# EAGLE design StellaBlue (EAGLE 7.3.0)
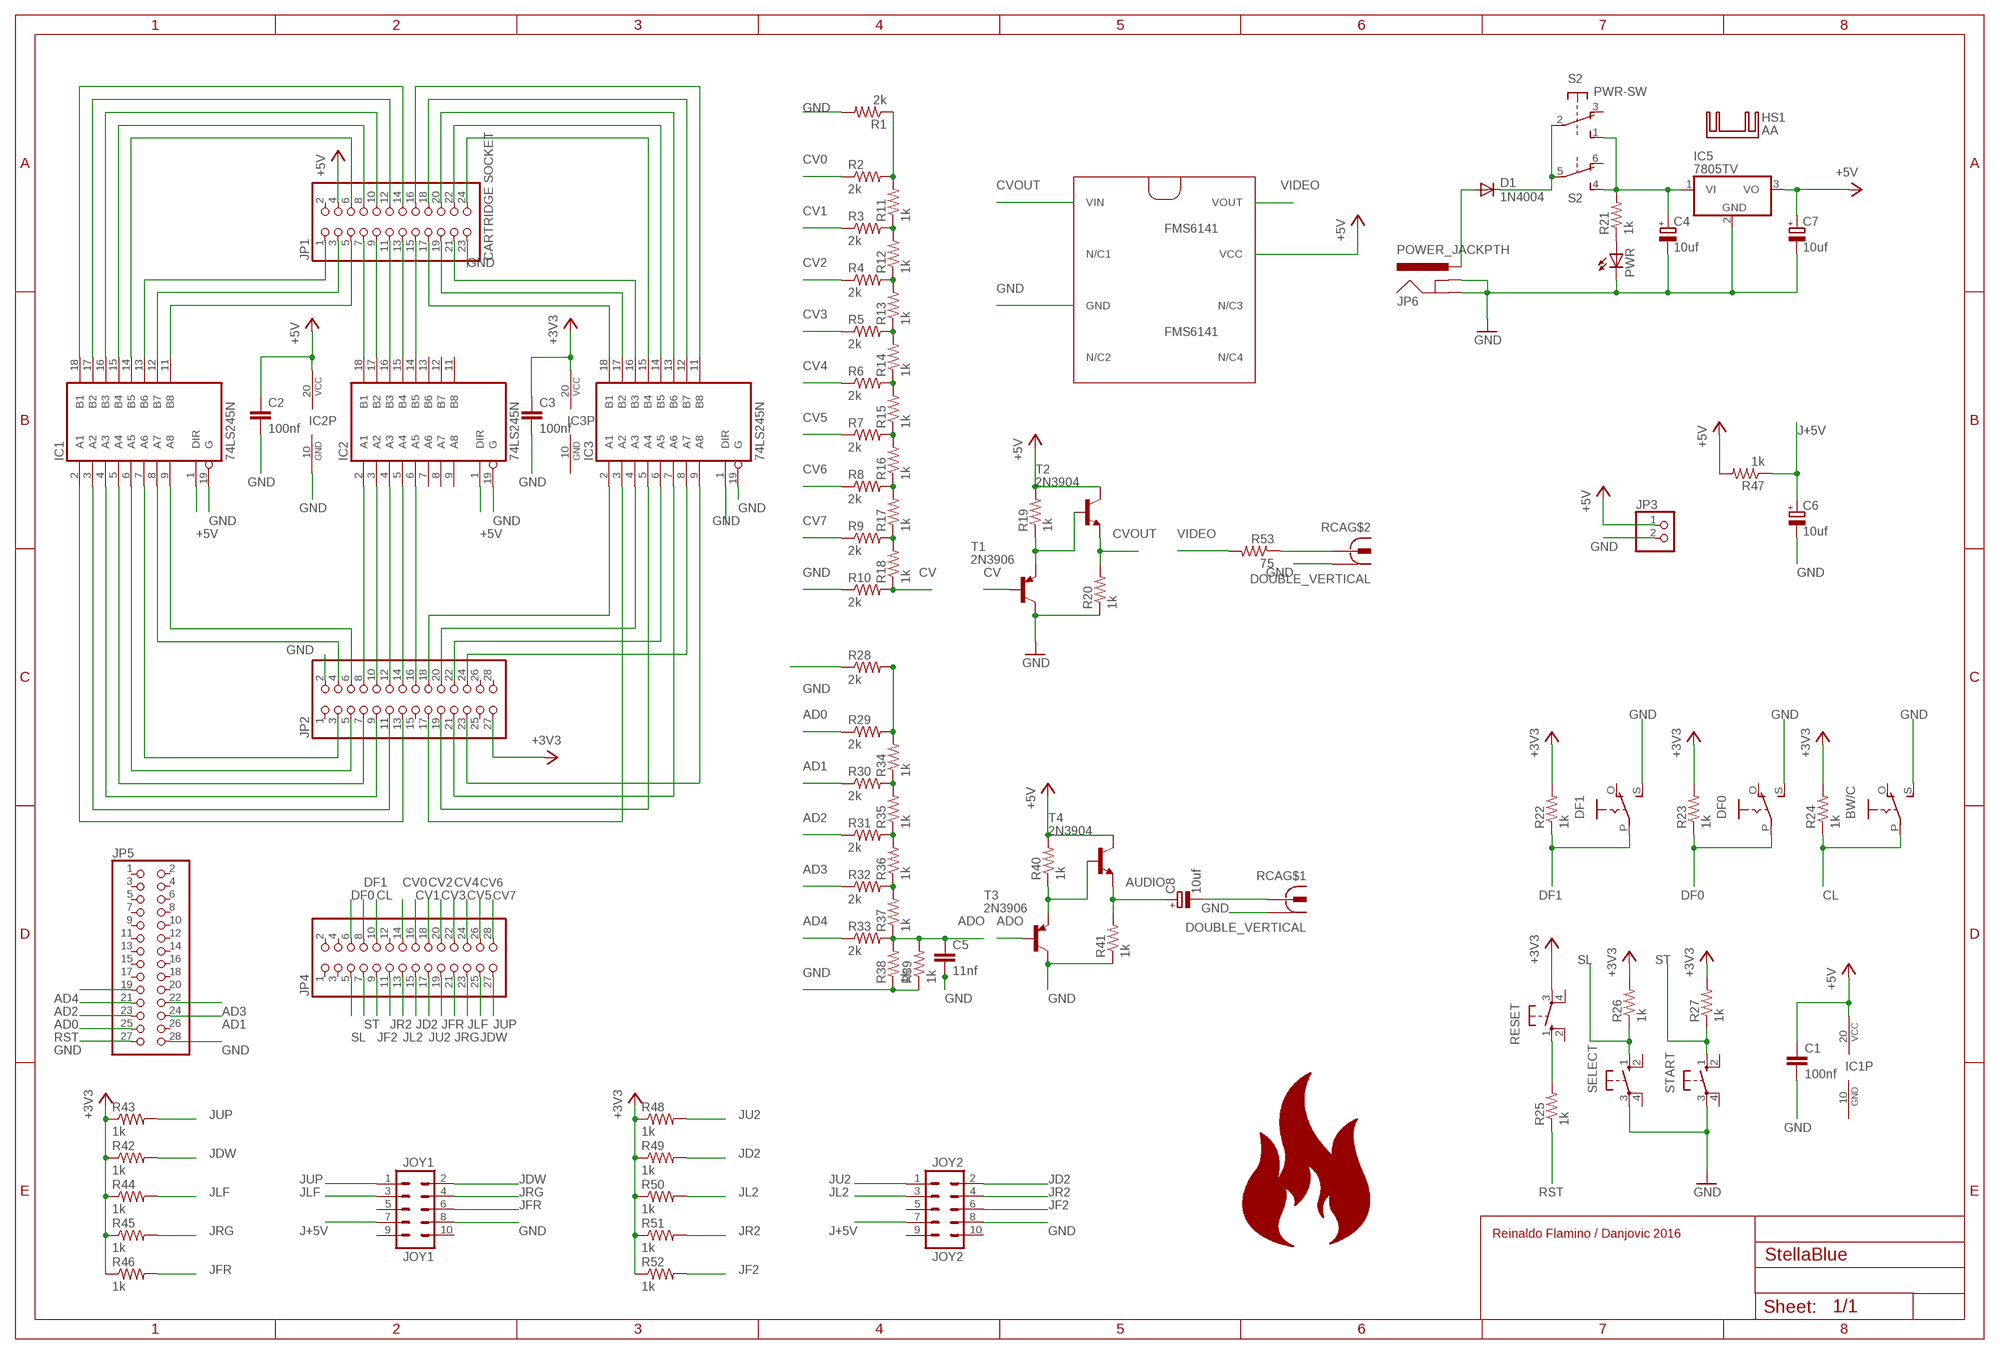
[diagram p0: schematic, sheet 1]

## Parts
BW/C  EG1218S  [EG1218]
C1  100nf  C5/2.5  [C5B2.5]
C2  100nf  C5/2.5  [C5B2.5]
C3  100nf  C5/2.5  [C5B2.5]
C4  10uf  CPOL-EUE2.5-6  [E2,5-6]
C5  11nf  C5/2.5  [C5B2.5]
C6  10uf  CPOL-EUTT2D6  [TT2D6]
C7  10uf  CPOL-EUE2.5-6  [E2,5-6]
C8  10uf  CPOL-EUE2.5-6  [E2,5-6]
D1  1N4004  [DO41-10]
DF0  EG1218S  [EG1218]
DF1  EG1218S  [EG1218]
HS1  AA  [AA]
IC1  74LS245N  [DIL20]
IC2  74LS245N  [DIL20]
IC3  74LS245N  [DIL20]
IC4  FMS6141  [SOIC8]
IC5  7805TV  [TO220V]
JOY1  JOY1  M05X2SHD_LOCK  [2X5-SHROUDED_LOCK]
JOY2  JOY2  M05X2SHD_LOCK  [2X5-SHROUDED_LOCK]
JP1  CARTRIDGE SOCKET  ATARI2600_SLOT  [ATARI2600_SLOT]
JP2  PINHD-2X14  [2X14]
JP3  PINHD-1X2/90  [1X02/90]
JP4  PINHD-2X14  [2X14]
JP5  PINHD-2X14  [2X14]
JP6  POWER_JACKPTH  [POWER_JACK_PTH]
PWR  LED3MM  [LED3MM]
R1  2k  R-US_0207/7  [0207/7]
R2  2k  R-US_0207/7  [0207/7]
R3  2k  R-US_0207/7  [0207/7]
R4  2k  R-US_0207/7  [0207/7]
R5  2k  R-US_0207/7  [0207/7]
R6  2k  R-US_0207/7  [0207/7]
R7  2k  R-US_0207/7  [0207/7]
R8  2k  R-US_0207/7  [0207/7]
R9  2k  R-US_0207/7  [0207/7]
R10  2k  R-US_0207/7  [0207/7]
R11  1k  R-US_0207/7  [0207/7]
R12  1k  R-US_0207/7  [0207/7]
R13  1k  R-US_0207/7  [0207/7]
R14  1k  R-US_0207/7  [0207/7]
R15  1k  R-US_0207/7  [0207/7]
R16  1k  R-US_0207/7  [0207/7]
R17  1k  R-US_0207/7  [0207/7]
R18  1k  R-US_0207/7  [0207/7]
R19  1k  R-US_0207/7  [0207/7]
R20  1k  R-US_0207/7  [0207/7]
R21  1k  R-US_0207/7  [0207/7]
R22  1k  R-US_0207/7  [0207/7]
R23  1k  R-US_0207/7  [0207/7]
R24  1k  R-US_0207/7  [0207/7]
R25  1k  R-US_0207/7  [0207/7]
R26  1k  R-US_0207/7  [0207/7]
R27  1k  R-US_0207/7  [0207/7]
R28  2k  R-US_0207/7  [0207/7]
R29  2k  R-US_0207/7  [0207/7]
R30  2k  R-US_0207/7  [0207/7]
R31  2k  R-US_0207/7  [0207/7]
R32  2k  R-US_0207/7  [0207/7]
R33  2k  R-US_0207/7  [0207/7]
R34  1k  R-US_0207/7  [0207/7]
R35  1k  R-US_0207/7  [0207/7]
R36  1k  R-US_0207/7  [0207/7]
R37  1k  R-US_0207/7  [0207/7]
R38  1k  R-US_0207/7  [0207/7]
R39  1k  R-US_0207/7  [0207/7]
R40  1k  R-US_0207/7  [0207/7]
R41  1k  R-US_0207/7  [0207/7]
R42  1k  R-US_0207/7  [0207/7]
R43  1k  R-US_0207/7  [0207/7]
R44  1k  R-US_0207/7  [0207/7]
R45  1k  R-US_0207/7  [0207/7]
R46  1k  R-US_0207/7  [0207/7]
R47  1k  R-US_0207/7  [0207/7]
R48  1k  R-US_0207/7  [0207/7]
R49  1k  R-US_0207/7  [0207/7]
R50  1k  R-US_0207/7  [0207/7]
R51  1k  R-US_0207/7  [0207/7]
R52  1k  R-US_0207/7  [0207/7]
R53  75  R-US_0207/7  [0207/7]
RCA  DOUBLE_VERTICAL  [DOUBLE-VERTICAL]
RESET  10-XX  [B3F-10XX]
S2  PWR-SW  9077-2  [9077-2]
SELECT  10-XX  [B3F-10XX]
START  10-XX  [B3F-10XX]
T1  2N3906  2N3906-PNP-TO92-EBC  [TO92-EBC]
T2  2N3904  2N3904-NPN-TO92-EBC  [TO92-EBC]
T3  2N3906  2N3906-PNP-TO92-EBC  [TO92-EBC]
T4  2N3904  2N3904-NPN-TO92-EBC  [TO92-EBC]

## Nets
+3V3: C3.1 IC3.20(VCC) JP2.27 R22.2 R23.2 R24.2 R26.2 R27.2 R42.1 R43.1 R44.1 R45.1 R46.1 R48.1 R49.1 R50.1 R51.1 R52.1 RESET.3(P)
+5V: C1.1 C2.1 C7.+ IC1.1(DIR) IC1.20(VCC) IC2.1(DIR) IC2.20(VCC) IC4.6(VCC) IC5.3(VO) JP1.4 JP3.1 R19.2 R40.2 R47.2 T2.C T4.C
AD0: JP5.23 R29.1
AD1: JP5.24 R30.1
AD2: JP5.21 R31.1
AD3: JP5.22 R32.1
AD4: JP5.19 R33.1
ADO: C5.1 R33.2 R37.1 R38.2 R39.2 T3.B
AUDIO: C8.+ R41.2 T4.E
CL: BW/C.P JP4.10 R24.1
CV: R10.2 R18.1 T1.B
CV0: JP4.14 R2.1
CV1: JP4.16 R3.1
CV2: JP4.18 R4.1
CV3: JP4.20 R5.1
CV4: JP4.22 R6.1
CV5: JP4.24 R7.1
CV6: JP4.26 R8.1
CV7: JP4.28 R9.1
CVOUT: IC4.1(VIN) R20.2 T2.E
DF0: DF0.P JP4.6 R23.1
DF1: DF1.P JP4.8 R22.1
GND: BW/C.S C1.2 C2.2 C3.2 C4.- C5.2 C6.- C7.- DF0.S DF1.S IC1.19(G) IC2.10(GND) IC2.19(G) IC3.1(DIR) IC3.19(G) IC4.3(GND) IC5.2(GND) JOY1.8 JOY2.8 JP1.23 JP2.2 JP3.2 JP5.27 JP5.28 JP6.GND JP6.GNDBREAK PWR.K(C) R1.2 R10.1 R20.1 R28.1 R38.1 R39.1 R41.1 RCA.HG RCA.LG SELECT.3(P) START.3(P) T1.C T3.C
J+5V: C6.+ JOY1.7 JOY2.7 R47.1
JD2: JOY2.2 JP4.15 R49.2
JDW: JOY1.2 JP4.25 R42.2
JF2: JOY2.6 JP4.9 R52.2
JFR: JOY1.6 JP4.19 R46.2
JL2: JOY2.3 JP4.13 R50.2
JLF: JOY1.3 JP4.23 R44.2
JR2: JOY2.4 JP4.11 R51.2
JRG: JOY1.4 JP4.21 R45.2
JU2: JOY2.1 JP4.17 R48.2
JUP: JOY1.1 JP4.27 R43.2
N$1: IC1.18(B1) JP1.14
N$2: IC1.17(B2) JP1.12
N$3: IC1.16(B3) JP1.10
N$4: IC1.15(B4) JP1.8
N$5: IC1.14(B5) JP1.6
N$6: IC1.13(B6) JP1.1
N$7: IC1.12(B7) JP1.3
N$8: IC1.11(B8) JP1.5
N$9: IC2.18(B1) JP1.7
N$10: IC2.17(B2) JP1.9
N$11: IC2.16(B3) JP1.11
N$12: IC2.15(B4) JP1.13
N$13: IC2.14(B5) JP1.15
N$14: IC3.18(B1) JP1.17
N$15: IC3.17(B2) JP1.19
N$16: IC3.16(B3) JP1.21
N$17: IC3.15(B4) JP1.24
N$18: IC3.14(B5) JP1.22
N$19: IC3.13(B6) JP1.20
N$20: IC3.12(B7) JP1.18
N$21: IC3.11(B8) JP1.16
N$22: IC1.2(A1) JP2.13
N$23: IC1.3(A2) JP2.11
N$24: IC1.4(A3) JP2.9
N$25: IC1.5(A4) JP2.7
N$26: IC1.6(A5) JP2.5
N$27: IC1.7(A6) JP2.3
N$28: IC1.8(A7) JP2.4
N$29: IC1.9(A8) JP2.6
N$30: IC2.2(A1) JP2.8
N$31: IC2.3(A2) JP2.10
N$32: IC2.4(A3) JP2.12
N$33: IC2.5(A4) JP2.14
N$34: IC2.6(A5) JP2.16
N$35: IC3.2(A1) JP2.18
N$36: IC3.3(A2) JP2.17
N$37: IC3.4(A3) JP2.20
N$38: IC3.5(A4) JP2.19
N$39: IC3.6(A5) JP2.22
N$40: IC3.7(A6) JP2.21
N$41: IC3.8(A7) JP2.24
N$42: IC3.9(A8) JP2.23
N$43: D1.A JP6.PWR
N$44: D1.C S2.2(1:P) S2.5(2:P)
N$45: R1.1 R2.2 R11.2
N$46: R3.2 R11.1 R12.2
N$47: R53.1 RCA.LS
N$49: C4.+ IC5.1(VI) R21.2 S2.1(1:S) S2.4(2:S)
N$50: R4.2 R12.1 R13.2
N$51: R5.2 R13.1 R14.2
N$52: R6.2 R14.1 R15.2
N$53: R7.2 R15.1 R16.2
N$54: R8.2 R16.1 R17.2
N$55: R9.2 R17.1 R18.2
N$57: R19.1 T1.E T2.B
N$58: PWR.A R21.1
N$59: R25.2 RESET.1(S)
N$62: R28.2 R29.2 R34.2
N$63: R30.2 R34.1 R35.2
N$64: R31.2 R35.1 R36.2
N$65: R32.2 R36.1 R37.2
N$67: R40.1 T3.E T4.B
N$68: C8.- RCA.HS
RST: JP5.25 R25.1
SL: JP4.5 R26.1 SELECT.1(S)
ST: JP4.7 R27.1 START.1(S)
VIDEO: IC4.5(VOUT) R53.2
Unconnected: BW/C.O DF0.O DF1.O IC2.7(A6) IC2.8(A7) IC2.9(A8) IC2.11(B8) IC2.12(B7) IC2.13(B6) IC4.2(N/C1) IC4.4(N/C2) IC4.7(N/C3) IC4.8(N/C4) JOY1.5 JOY1.9 JOY1.10 JOY2.5 JOY2.9 JOY2.10 JP1.2 JP2.1 JP2.15 JP2.25 JP2.26 JP2.28 JP4.1 JP4.2 JP4.3 JP4.4 JP4.12 JP5.1 JP5.2 JP5.3 JP5.4 JP5.5 JP5.6 JP5.7 JP5.8 JP5.9 JP5.10 JP5.11 JP5.12 JP5.13 JP5.14 JP5.15 JP5.16 JP5.17 JP5.18 JP5.20 JP5.26 RESET.2(S1) RESET.4(P1) S2.3(1:O) S2.6(2:O) SELECT.2(S1) SELECT.4(P1) START.2(S1) START.4(P1)

## Notes on the sheet
- Reinaldo Flamino / Danjovic 2016

## Power pins joined to a net without a drawn wire
GND: IC1.10(GND) IC3.10(GND)

## Library data of the parts
BW/C DF0 DF1 = adafruit:EG1218: SLIDING SWITCH 0.1" spacing through hole, vertical SPDT slide switch http://www.ladyada.net/library/pcb/eaglelibrary.html
C1-C3 C5 = capacitor-wima:C: CAPACITOR naming: grid - package width
C4 C6-C8 = resistor:CPOL-EU: POLARIZED CAPACITOR, European symbol
D1 = adafruit:1N4004: DIODE General purpose 1N400x type rectifier (With bigger pads) http://www.ladyada.net/library/pcb/eaglelibrary.html
HS1 = heatsink:AA
IC1-IC3 = 74xx-us:74*245: Octal BUS TRANSCEIVER, 3-state
IC4 = Misc:FMS6141: VIDEO FILTER
IC5 = linear:78*: Positive VOLTAGE REGULATOR Source: http://cache.national.com/ds/LM/LM78L05.pdf http://www.fairchildsemi.com/ds/LM/LM7805.pdf
JOY1 JOY2 = SparkFun-Connectors:M05X2: Header 5x2 Standard 10-pin dual row 0.1" header. Commonly used with AVR-ISP. Use with Spark Fun Electronics SKU: PRT-00778
JP1 = atari2600 card edge:ATARI2600_SLOT: Atari 2600 Slot connector Based on Sullins card edge connector 12/24 pin
JP2 JP4 JP5 = pinhead:PINHD-2X14: PIN HEADER
JP3 = pinhead:PINHD-1X2: PIN HEADER
JP6 = SparkFun-Connectors:POWER_JACK: Power Jack This is the standard 5.5mm barrel jack for power. The PTH is the most common, proven, reliable, footprint. The Slot footprint only works if the mill layer is transmitted to the PCB fab house so be warned. Mating wall wart : TOL-00298 (and others); PROD_ID: CONN-08197
PWR = led:LED: LED OSRAM: - CHIPLED LG R971, LG N971, LY N971, LG Q971, LY Q971, LO R971, LY R971 LH N974, LH R974 LS Q976, LO Q976, LY Q976 LO Q996 - Hyper CHIPLED LW Q18S LB Q993, LB Q99A, LB R99A - SideLED LS A670, LO A670, LY A670, LG A670, LP A670 LB A673, LV A673, LT A673, LW A673 LH A674 LY A675 LS A676, LA A676, LO A676, LY A676, LW A676 LS A679, LY A679, LG A679 - Hyper Micro SIDELED® LS Y876, LA Y876, LO Y876, LY Y876 LT Y87S - SmartLED LW L88C, LW L88S LB L89C, LB L89S, LG L890 LS L89K, LO L89K, LY L89K LS L896, LA L896, LO L896, LY L896 - TOPLED LS T670, LO T670, LY T670, LG T670, LP T670 LSG T670, LSP T670, LSY T670, LOP T670, LYG T670 LG T671, LOG T671, LSG T671 LB T673, LV T673, LT T673, LW T673 LH T674 LS T676, LA T676, LO T676, LY T676, LB T676, LH T676, LSB T676, LW T676 LB T67C, LV T67C, LT T67C, LS T67K, LO T67K, LY T67K, LW E67C LS E67B, LA E67B, LO E67B, LY E67B, LB E67C, LV E67C, LT E67C LW T67C LS T679, LY T679, LG T679 LS T770, LO T770, LY T770, LG T770, LP T770 LB T773, LV T773, LT T773, LW T773 LH T774 LS E675, LA E675, LY E675, LS T675 LS T776, LA T776, LO T776, LY T776, LB T776 LHGB T686 LT T68C, LB T68C - Hyper Mini TOPLED® LB M676 - Mini TOPLED Santana® LG M470 LS M47K, LO M47K, LY M47K Source: http://www.osram.convergy.de LUXEON: - LUMILED® LXK2-PW12-R00, LXK2-PW12-S00, LXK2-PW14-U00, LXK2-PW14-V00 LXK2-PM12-R00, LXK2-PM12-S00, LXK2-PM14-U00 LXK2-PE12-Q00, LXK2-PE12-R00, LXK2-PE12-S00, LXK2-PE14-T00, LXK2-PE14-U00 LXK2-PB12-K00, LXK2-PB12-L00, LXK2-PB12-M00, LXK2-PB14-N00, LXK2-PB14-P00, LXK2-PB14-Q00 LXK2-PR12-L00, LXK2-PR12-M00, LXK2-PR14-Q00, LXK2-PR14-R00 LXK2-PD12-Q00, LXK2-PD12-R00, LXK2-PD12-S00 LXK2-PH12-R00, LXK2-PH12-S00 LXK2-PL12-P00, LXK2-PL12-Q00, LXK2-PL12-R00 Source: www.luxeon.com KINGBRIGHT: KA-3528ASYC Source: www.kingbright.com
R1-R53 = resistor:R-US_: RESISTOR, American symbol
RCA = con-rca-board:DOUBLE_VERTICAL
RESET SELECT START = switch-omron:10-XX: OMRON SWITCH; MPN: B3F-1000; OC_FARNELL: 176432; OC_NEWARK: 36M3542
S2 = switch-misc:9077-2: MARQUARDT SWITCH 9077.0200 Distributor: Buerklin <https://www.buerklin.com/default.asp?event=ShowArtikel%2812G2822%29&l=d&jump=ArtNr_12G2822>
T1 T3 = transistor-neu-to92:*-PNP-: PNP Transistror
T2 T4 = transistor-neu-to92:*-NPN-: NPN Transistror

## Board
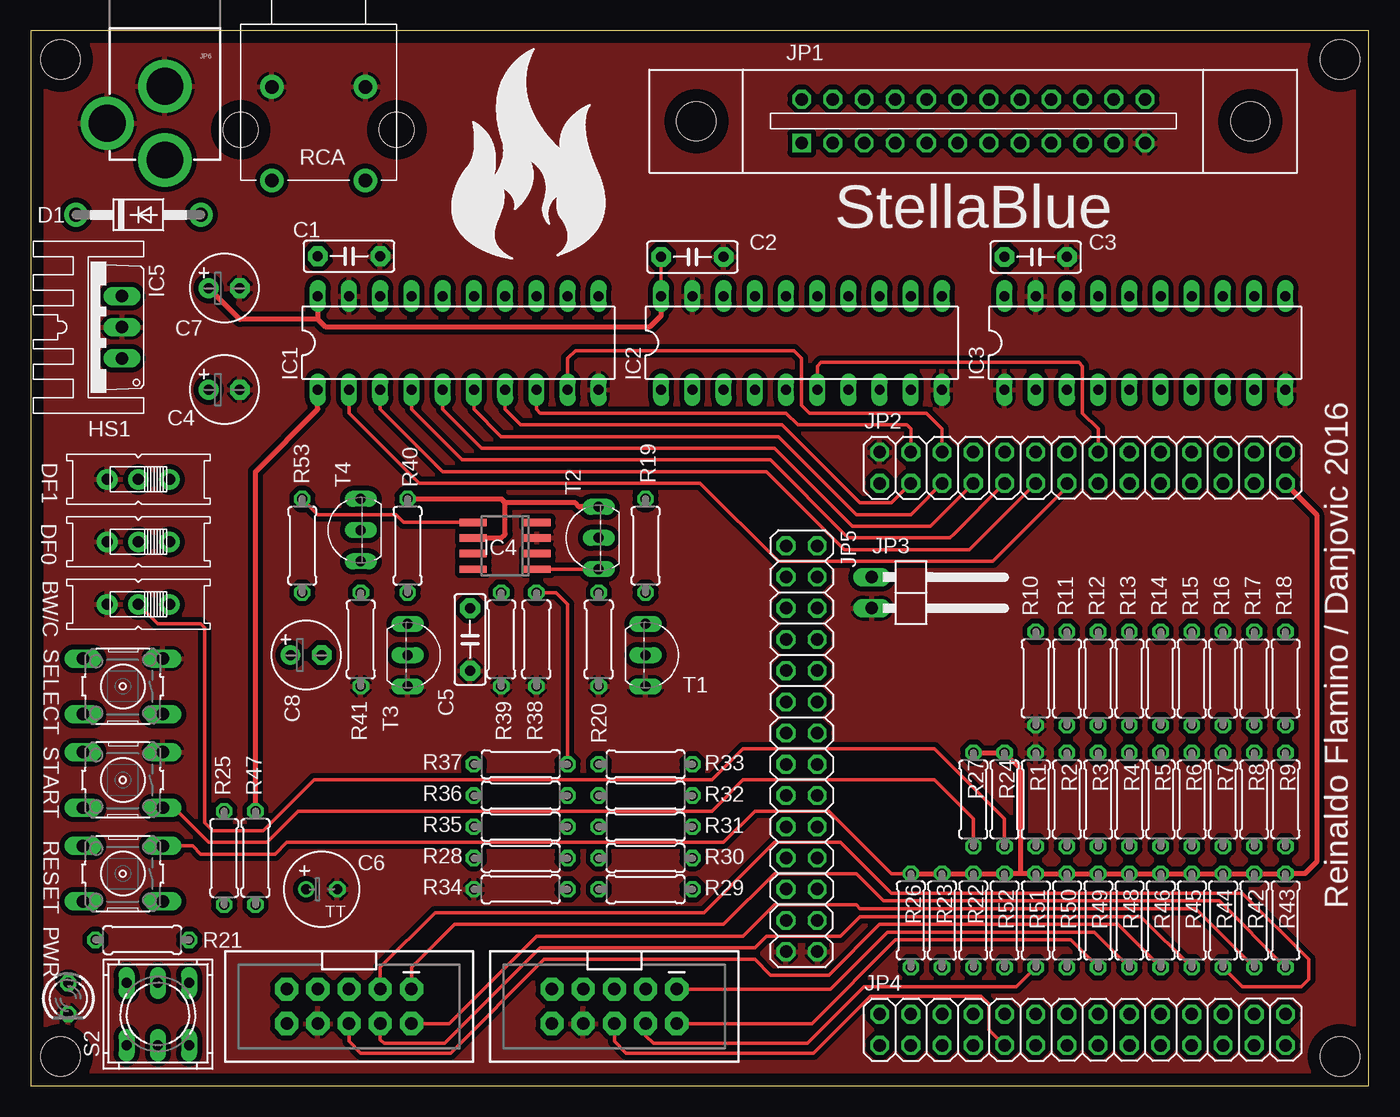
[diagram p1: board, top side]
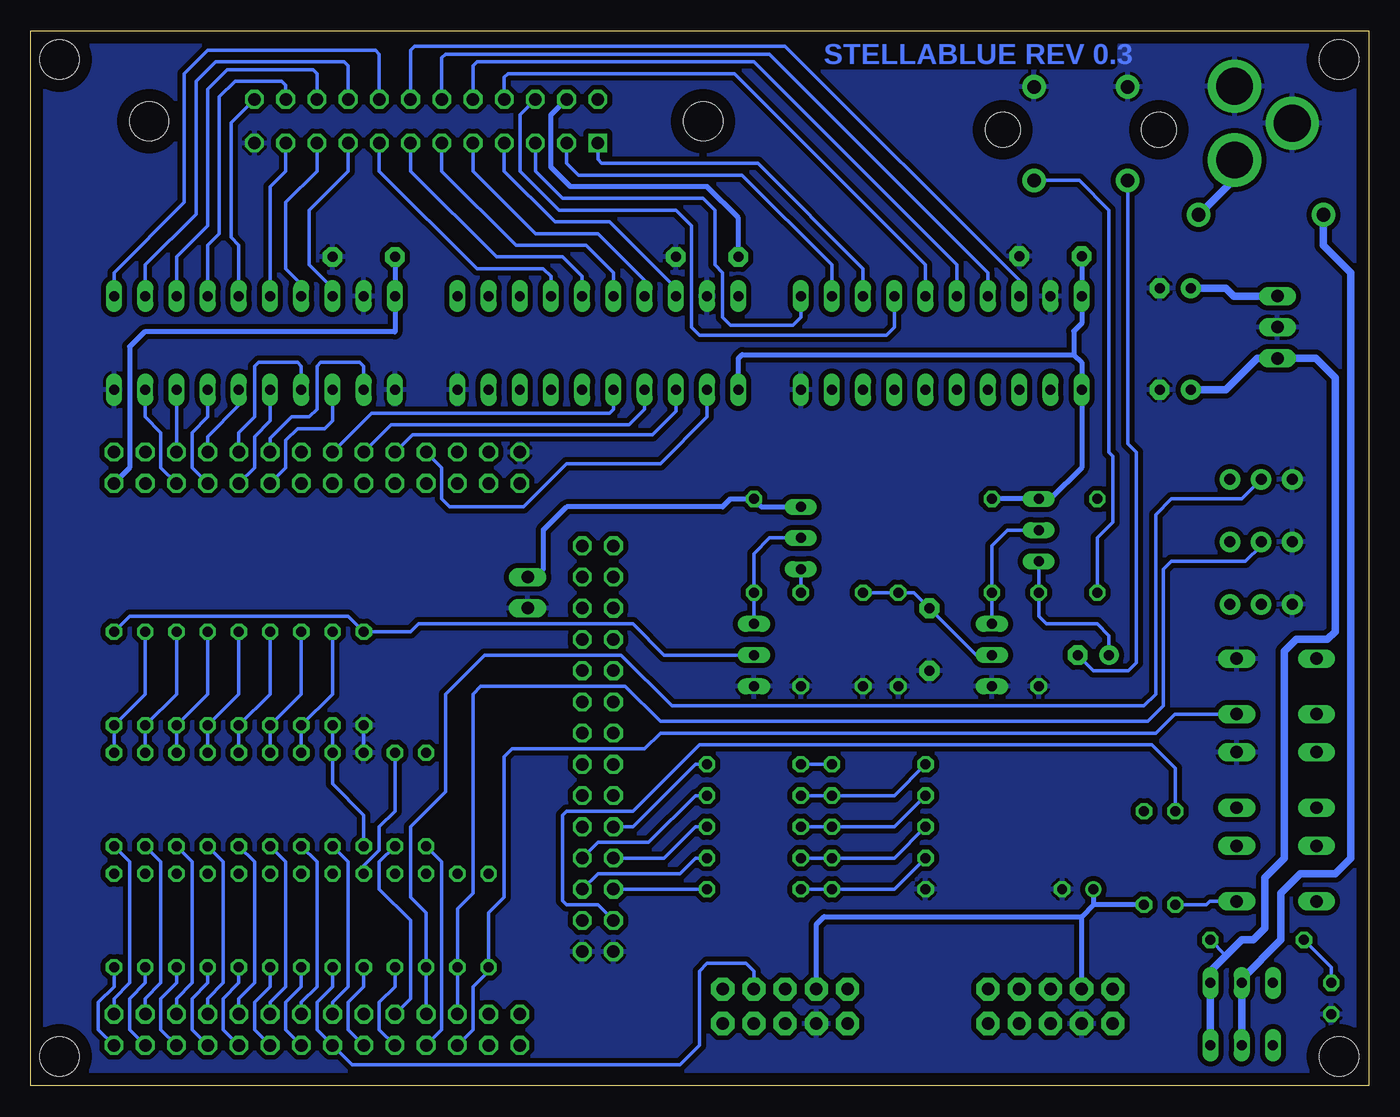
[diagram p2: board, bottom side, seen from below]

Size 108.89 x 85.84 mm. Coordinates in mm from the lower left corner, seen from the top.
Outline: 0,0 108.89,0 108.89,85.84 0,85.84 0,0
Copper layers (1*16): Top 0.035mm / dielectric 1.5mm / Bottom 0.035mm
Design rules "default *": minimum track width 12mil, minimum drill 24mil, track to track 8mil, track to pad 8mil, pad to pad 8mil, via to via 8mil, smd to smd 8mil, copper to edge 40mil, drill to drill 8mil, minimum pad ring 10mil, minimum via ring 8mil, stop-mask expansion 4mil, vias tented up to drill 0mil, thermal gap 10mil
Holes 3.2 mm at 2.41,83.5 2.41,2.41 106.55,2.41 106.55,83.5

### Footprints (pad centres in the part's own frame; a part is rotated, then mirrored left to right if it is on the bottom)
EG1218 = drill 0.9 pad 1.676: O -2.54,0; P 0,0; S 2.54,0
C5B2.5 = drill 0.813 pad 1.6 octagon: 1 -2.54,0; 2 2.54,0
E2,5-6 = drill 0.813 pad 1.6: + -1.27,0 | drill 0.813 pad 1.6 octagon: - 1.27,0
TT2D6 = drill 0.813: + -1.27,0 | drill 0.813 octagon: - 1.27,0
DO41-10 = drill 1.118 pad 1.93: A 5.08,0; C -5.08,0
DIL20 = drill 0.813 long: 1 -11.43,-3.81; 2 -8.89,-3.81; 3 -6.35,-3.81; 4 -3.81,-3.81; 5 -1.27,-3.81; 6 1.27,-3.81; 7 3.81,-3.81; 8 6.35,-3.81; 9 8.89,-3.81; 10 11.43,-3.81; 11 11.43,3.81; 12 8.89,3.81; 13 6.35,3.81; 14 3.81,3.81; 15 1.27,3.81; 16 -1.27,3.81; 17 -3.81,3.81; 18 -6.35,3.81; 19 -8.89,3.81; 20 -11.43,3.81
SOIC8 = smd 0.6 x 2.2: 1 -1.905,-2.6; 2 -0.635,-2.6; 3 0.635,-2.6; 4 1.905,-2.6; 5 1.905,2.6; 6 0.635,2.6; 7 -0.635,2.6; 8 -1.905,2.6
TO220V = drill 1.016 long: 1 -2.54,-2.54; 2 0,-2.54; 3 2.54,-2.54
2X5-SHROUDED_LOCK = drill 1.016 pad 1.88 octagon: 1 -1.397,5.08; 2 1.397,5.08; 3 -1.397,2.54; 4 1.397,2.54; 5 -1.397,0; 6 1.397,0; 7 -1.397,-2.54; 8 1.397,-2.54; 9 -1.397,-5.08; 10 1.397,-5.08
ATARI2600_SLOT = drill 1.016 square: 1 -13.97,-1.778 | drill 1.016 octagon: 2 -13.97,1.778; 3 -11.43,-1.778; 4 -11.43,1.778; 5 -8.89,-1.778; 6 -8.89,1.778; 7 -6.35,-1.778; 8 -6.35,1.778; 9 -3.81,-1.778; 10 -3.81,1.778; 11 -1.27,-1.778; 12 -1.27,1.778; 13 1.27,-1.778; 14 1.27,1.778; 15 3.81,-1.778; 16 3.81,1.778; 17 6.35,-1.778; 18 6.35,1.778; 19 8.89,-1.778; 20 8.89,1.778; 21 11.43,-1.778; 22 11.43,1.778; 23 13.97,-1.778; 24 13.97,1.778 | hole 3.175: -22.543,0; 22.543,0
2X14 = drill 1.016 octagon: 1 -16.51,-1.27; 2 -16.51,1.27; 3 -13.97,-1.27; 4 -13.97,1.27; 5 -11.43,-1.27; 6 -11.43,1.27; 7 -8.89,-1.27; 8 -8.89,1.27; 9 -6.35,-1.27; 10 -6.35,1.27; 11 -3.81,-1.27; 12 -3.81,1.27; 13 -1.27,-1.27; 14 -1.27,1.27; 15 1.27,-1.27; 16 1.27,1.27; 17 3.81,-1.27; 18 3.81,1.27; 19 6.35,-1.27; 20 6.35,1.27; 21 8.89,-1.27; 22 8.89,1.27; 23 11.43,-1.27; 24 11.43,1.27; 25 13.97,-1.27; 26 13.97,1.27; 27 16.51,-1.27; 28 16.51,1.27
1X02/90 = drill 1.016 long: 1 -1.27,-3.81; 2 1.27,-3.81
POWER_JACK_PTH = drill 2.997 pad 4.318: GND 0,7.7; GNDBREAK 4.7,10.7; PWR 0,13.7
LED3MM = drill 0.813 octagon: A -1.27,0; K 1.27,0
0207/7 = drill 0.813 octagon: 1 -3.81,0; 2 3.81,0
DOUBLE-VERTICAL = drill 1.1 pad 1.93: HG -3.81,3.81; HS -3.81,-3.81; LG 3.81,3.81; LS 3.81,-3.81 | hole 2.8: -6.35,0.318; 6.35,0.318
B3F-10XX = drill 1.016 long: 1 -3.251,2.261; 2 3.251,2.261; 3 -3.251,-2.261; 4 3.251,-2.261
9077-2 = drill 0.813 long: 1 -2.54,2.54; 2 0,2.54; 3 2.54,2.54; 4 -2.54,-2.54; 5 0,-2.54; 6 2.54,-2.54
TO92-EBC = drill 0.813 long: B 0,-1.27; C 2.54,-1.27; E -2.54,-1.27

### Placement (x,y rotation side)
BW/C  8.76,39.18 180 top
C1  25.91,67.5 0 top
C2  53.85,67.44 0 top
C3  81.79,67.44 0 top
C4  15.75,56.64 0 top
C5  35.75,36.32 270 top
C6  23.69,16 0 top
C7  15.75,64.9 0 top
C8  22.42,35.05 0 top
D1  8.76,70.87 0 top
DF0  8.76,44.26 180 top
DF1  8.76,49.34 180 top
HS1  0.19,61.72 270 top
IC1  34.8,60.45 0 top
IC2  62.74,60.45 0 top
IC3  90.68,60.45 0 top
IC4  38.61,43.94 90 top
IC5  4.89,61.72 90 top
JOY1  25.91,6.48 270 top
JOY2  47.5,6.48 270 top
JP1  76.71,78.49 0 top
JP2  85.6,50.29 0 top
JP3  72.26,40.13 270 top
JP4  85.6,4.57 0 top
JP5  62.74,27.43 270 top
JP6  10.92,89.03 180 top
PWR  3.05,7.11 270 top
R1  81.79,23.3 90 top
R2  84.33,23.3 90 top
R3  86.87,23.3 90 top
R4  89.41,23.3 90 top
R5  91.95,23.3 90 top
R6  94.49,23.3 90 top
R7  97.03,23.3 90 top
R8  99.57,23.3 90 top
R9  102.11,23.3 90 top
R10  81.79,33.15 90 top
R11  84.33,33.15 270 top
R12  86.87,33.15 270 top
R13  89.41,33.15 270 top
R14  91.95,33.15 270 top
R15  94.49,33.15 270 top
R16  97.03,33.15 270 top
R17  99.57,33.15 270 top
R18  102.11,33.15 270 top
R19  50.04,43.94 90 top
R20  46.23,36.32 90 top
R21  9.08,11.87 0 top
R22  76.71,13.46 90 top
R23  74.17,13.46 90 top
R24  79.25,23.3 90 top
R25  15.75,18.54 270 top
R26  71.63,13.46 90 top
R27  76.71,23.3 90 top
R28  39.88,16 0 top
R29  50.04,16 180 top
R30  50.04,18.54 180 top
R31  50.04,21.08 180 top
R32  50.04,23.62 180 top
R33  50.04,26.16 180 top
R34  39.88,18.54 180 top
R35  39.88,21.08 180 top
R36  39.88,23.62 180 top
R37  39.88,26.16 180 top
R38  41.15,36.32 90 top
R39  38.29,36.32 90 top
R40  30.67,43.94 90 top
R41  26.86,36.32 90 top
R42  99.57,13.46 270 top
R43  102.11,13.46 270 top
R44  97.03,13.46 270 top
R45  94.49,13.46 270 top
R46  91.95,13.46 270 top
R47  18.29,18.54 90 top
R48  89.41,13.46 270 top
R49  86.87,13.46 270 top
R50  84.33,13.46 270 top
R51  81.79,13.46 270 top
R52  79.25,13.46 270 top
R53  22.1,43.94 90 top
RCA  23.43,77.47 0 top
RESET  7.49,17.27 180 top
S2  10.35,5.84 180 top
SELECT  7.49,32.51 180 top
START  7.49,24.89 180 top
T1  51.31,35.05 270 top
T2  44.96,44.58 90 top
T3  31.94,35.05 270 top
T4  25.59,45.21 90 top

### Tracks (layer width: path | path; a pad name or v marks a point on that pad's centre or on a via)
+3V3
  Top 0.305: RESET.3 13.17,19.53 13.84,18.86 19.88,18.86 20.83,19.81 56.39,19.81 58.93,22.35 64.96,22.35 70.04,17.27 R26.2
  Top 0.406: R26.2 R23.2 R22.2 R52.1 80.52,17.27 | 80.52,17.27 R51.1 R50.1 R49.1 R48.1 R46.1 R45.1 R44.1 R42.1 R43.1 103.7,17.27 104.65,18.22 104.65,46.48 JP2.27 | R27.2 R24.2 80.52,25.84 80.52,17.27
  Bottom 0.305: R51.1 81.79,17.91 80.52,19.18 80.52,21.08 79.25,22.35 R24.2
  Bottom 0.406: JP2.27 100.84,50.29 100.84,60.13 99.63,61.34 79.25,61.34 IC3.20 C3.1
+5V
  Top 0.305: IC2.20 C2.1
  Top 0.406: IC4.6 38.29,44.58 38.61,44.9 38.61,47.43 | 38.61,47.43 38.29,47.75 R40.2 | T2.C 44.64,47.12 44.32,47.43 38.61,47.43 | R47.2 18.29,49.97 23.37,55.05 IC1.1 | 23.37,62.36 IC1.20 23.37,63.31 | 23.37,62.36 17.02,62.36 C7.+ | IC2.20 51.31,62.67 50.36,61.72 24,61.72 23.37,62.36
  Bottom 0.406: R40.2 T4.C 25.91,47.75 23.37,50.29 IC1.1 23.37,58.86 24,59.5 | T2.C 49.4,47.12 R19.2 51.94,47.75 52.58,47.12 65.28,47.12 67.18,45.21 67.18,42.04 67.82,41.4 JP3.1 | C1.1 IC1.20 23.37,62.04 24,61.4 24,59.5 | C2.1 51.31,70.61 53.85,73.15 64.96,73.15 66.55,74.74 66.55,78.99 JP1.4 | IC2.1 51.31,59.18 50.99,59.5 24,59.5
  Bottom 0.61: IC5.3 10.98,64.26 11.62,64.9 C7.+
AD0
  Bottom 0.305: R29.1 JP5.23
AD1
  Bottom 0.305: JP5.24 62.74,17.27 56.07,17.27 54.8,18.54 R30.1
AD2
  Bottom 0.305: JP5.21 58.93,18.54 57.34,18.54 54.8,21.08 R31.1
AD3
  Bottom 0.305: JP5.22 62.74,19.81 60.2,19.81 58.61,19.81 54.8,23.62 R32.1
AD4
  Bottom 0.305: JP5.19 59.88,21.08 54.8,26.16 R33.1
ADO
  Top 0.305: R37.1 43.69,39.18 42.73,40.13 R38.2
  Bottom 0.305: T3.B 31.94,35.05 C5.1 37.02,40.13 R39.2 R38.2 | R33.2 R37.1
AUDIO
  Bottom 0.305: C8.+ 21.14,36.64 22.1,37.59 26.23,37.59 26.86,38.23 R41.2 T4.E
CL
  Top 0.305: BW/C.P 10.35,37.59 13.84,37.59 14.16,37.27 14.16,21.4 14.8,20.77 18.92,20.77 23.05,24.89 55.44,24.89 57.98,27.43 73.53,27.43 79.25,21.72 R24.1
  Bottom 0.305: JP4.10 77.98,7.11 77.98,13.46 80.52,16 80.52,18.22 R24.1
CV
  Bottom 0.305: R18.1 100.84,38.23 83.06,38.23 R10.2 77.98,36.96 77.34,37.59 59.88,37.59 57.34,35.05 T1.B
CV0
  Bottom 0.305: JP4.14 84.33,6.79 83.06,8.06 83.06,18.22 R2.1
CV1
  Bottom 0.305: JP4.16 86.87,6.79 85.6,8.06 85.6,18.22 R3.1
CV2
  Bottom 0.305: JP4.18 89.41,6.79 88.14,8.06 88.14,18.22 R4.1
CV3
  Bottom 0.305: JP4.20 91.95,7.11 90.68,8.38 90.68,18.22 R5.1
CV4
  Bottom 0.305: JP4.22 94.49,7.11 93.22,8.38 93.22,18.22 R6.1
CV5
  Bottom 0.305: JP4.24 97.03,7.11 95.76,8.38 95.76,18.22 R7.1
CV6
  Bottom 0.305: JP4.26 99.57,7.11 98.3,8.38 98.3,18.22 R8.1
CV7
  Bottom 0.305: JP4.28 102.11,7.11 100.84,8.38 100.84,18.22 R9.1
CVOUT
  Top 0.305: IC4.1 T2.E
  Bottom 0.305: T2.E R20.2
DF0
  Bottom 0.305: JP4.6 R23.1 74.17,14.41 72.9,15.68 72.9,31.88 72.26,32.51 60.52,32.51 57.66,29.65 17.97,29.65 16.7,30.93 16.7,42.04 16.07,42.67 10.03,42.67 8.76,43.94 DF0.P
DF1
  Bottom 0.305: JP4.8 R22.1 76.71,14.1 77.98,15.37 77.98,21.08 75.12,23.94 75.12,31.88 71.95,35.05 60.83,35.05 56.71,30.93 18.29,30.93 17.34,31.88 17.34,46.48 16.07,47.75 10.35,47.75 DF1.P
GND
  Bottom 0.305: R10.1 R1.2
  pour Bottom (isolate 0.406): 0,86.17 108.97,86.17 108.97,0 0,0
  pour Top (isolate 0.406): 0.32,85.85 109.28,85.85 108.97,0 0,0
J+5V
  Bottom 0.406: JOY2.7 44.96,13.14 44.32,13.78 23.37,13.78 | R47.1 22.41,14.73 | 22.41,14.73 23.37,13.78 | C6.+ 22.41,14.73 | JOY1.7 23.37,13.78
JD2
  Top 0.305: R49.2 84.65,11.88 70.36,11.88 63.56,5.08 JOY2.2
  Bottom 0.305: R49.2 86.87,8.06 88.14,6.79 88.14,4.57 JP4.15
JDW
  Top 0.305: R42.2 94.8,14.41 67.5,14.41 67.18,14.73 60.52,14.73 57.98,12.19 41.15,12.19 34.04,5.08 JOY1.2
  Bottom 0.305: JP4.25 100.84,4.57 100.84,7.11 99.57,8.38 R42.2
JF2
  Top 0.305: JOY2.6 47.5,3.62 48.45,2.67 63.69,2.67 68.33,7.3 77.34,7.3 77.98,6.67 77.98,4.57 JP4.9
  Bottom 0.305: JP4.9 80.52,4.57 80.52,6.79 79.25,8.06 R52.2
JFR
  Top 0.305: R46.2 88.46,13.14 69.09,13.14 64.96,9.02 60.2,9.02 58.93,10.29 41.78,10.29 34.16,2.67 26.86,2.67 25.91,3.62 JOY1.6
  Bottom 0.305: JP4.19 93.22,4.57 93.22,7.11 91.95,8.38 R46.2
JL2
  Bottom 0.305: R50.2 84.33,8.06 85.6,6.79 85.6,4.57 JP4.13 82.74,1.71 56.07,1.71 54.48,3.3 54.48,9.33 53.85,9.97 50.67,9.97 50.04,9.33 JOY2.3
JLF
  Top 0.305: R44.2 98.62,8.06 103.38,8.06 104.01,8.7 104.01,10.29 98.62,15.68 70.04,15.68 65.91,19.81 60.52,19.81 54.8,14.1 32.89,14.1 28.45,9.65 JOY1.3
  Bottom 0.305: JP4.23 98.3,4.57 98.3,7.11 97.03,8.38 R44.2
JR2
  Top 0.305: JOY2.4 50.04,4.1 50.67,3.46 63.21,3.46 67.82,8.06 80.2,8.06 R51.2
  Bottom 0.305: JP4.11 83.06,4.57 83.06,6.79 81.79,8.06 R51.2
JRG
  Top 0.305: R45.2 90.36,13.78 67.5,13.78 65.91,12.19 59.88,12.19 58.93,11.24 41.47,11.24 33.69,3.46 28.77,3.46 28.45,3.78 JOY1.4
  Bottom 0.305: JP4.21 95.76,4.57 95.76,7.11 94.49,8.38 R45.2
JU2
  Top 0.305: R48.2 86.55,12.51 69.72,12.51 65.09,7.87 JOY2.1
  Bottom 0.305: JP4.17 90.68,4.57 90.68,6.79 89.41,8.06 R48.2
JUP
  Top 0.305: JOY1.1 30.99,9.65 34.48,13.14 56.39,13.14 60.52,17.27 67.18,17.27 69.41,15.05 96.71,15.05 R43.2
  Bottom 0.305: JP4.27 103.38,4.57 103.38,6.79 102.11,8.06 R43.2
N$1
  Bottom 0.305: IC1.18 28.45,65.53 47.5,84.58 75.44,84.58 77.66,84.58 77.98,84.26 77.98,82.04 JP1.14
N$2
  Bottom 0.305: IC1.17 30.99,66.17 48.77,83.95 75.12,83.95 75.44,83.63 JP1.12
N$3
  Bottom 0.305: IC1.16 33.53,66.8 50.04,83.31 72.58,83.31 72.9,83 JP1.10
N$4
  Bottom 0.305: IC1.15 36.07,66.8 51.62,82.36 70.04,82.36 70.36,82.04 JP1.8
N$5
  Bottom 0.305: JP1.6 69.09,78.99 69.09,74.42 65.91,71.25 56.39,71.25 55.12,69.98 55.12,61.72 54.48,61.09 39.24,61.09 38.61,61.72 IC1.14
N$6
  Bottom 0.305: JP1.1 62.74,75.37 62.42,75.06 49.72,75.06 41.15,66.48 IC1.13
N$7
  Bottom 0.305: JP1.3 65.28,75.06 64.33,74.11 50.99,74.11 43.69,66.8 IC1.12
N$8
  Bottom 0.305: JP1.5 67.82,74.42 65.6,72.2 54.16,72.2 53.21,71.25 53.21,66.8 52.58,66.17 52.58,62.52 51.94,61.88 46.86,61.88 46.23,62.52 IC1.11
N$9
  Bottom 0.305: IC2.18 56.39,64.9 61.79,70.29 66.23,70.29 70.36,74.42 JP1.7
N$10
  Bottom 0.305: IC2.17 58.93,65.53 62.74,69.34 67.82,69.34 72.9,74.42 JP1.9
N$11
  Bottom 0.305: JP1.11 75.44,74.42 69.41,68.39 63.69,68.39 61.47,66.17 IC2.16
N$12
  Bottom 0.305: JP1.13 77.98,74.42 70.99,67.44 65.6,67.44 64.01,65.85 IC2.15
N$13
  Bottom 0.305: IC2.14 66.55,65.85 67.18,66.48 72.58,66.48 80.52,74.42 JP1.15
N$14
  Bottom 0.305: IC3.18 84.33,64.9 86.23,66.8 86.23,71.25 83.06,74.42 JP1.17
N$15
  Bottom 0.305: IC3.17 86.87,65.22 88.14,66.48 88.14,71.88 85.6,74.42 JP1.19
N$16
  Bottom 0.305: IC3.16 89.41,73.15 88.14,74.42 JP1.21
N$17
  Bottom 0.305: JP1.24 92.58,78.36 92.58,69.03 91.95,68.39 IC3.15
N$18
  Bottom 0.305: IC3.14 94.49,68.39 93.54,69.34 93.54,80.45 92.27,81.72 88.46,81.72 88.14,81.41 JP1.22
N$19
  Bottom 0.305: IC3.13 97.03,67.44 94.49,69.98 94.49,81.09 92.9,82.68 85.91,82.68 85.6,82.36 JP1.20
N$20
  Bottom 0.305: JP1.18 83.06,83 83.38,83.31 93.85,83.31 95.44,81.72 95.44,70.93 99.57,66.8 IC3.12
N$21
  Bottom 0.305: JP1.16 80.52,83.95 80.84,84.26 94.49,84.26 96.39,82.36 96.39,71.88 102.11,66.17 IC3.11
N$22
  Top 0.305: JP2.13 84.33,48.7 78.3,42.67 60.83,42.67 54.48,49.02 31.62,49.02 25.91,54.74 IC1.2
N$23
  Top 0.305: JP2.11 76.71,43.94 76.39,43.62 66.23,43.62 65.91,43.94 59.88,49.97 33.53,49.97 28.45,55.05 IC1.3
N$24
  Top 0.305: JP2.9 75.12,44.9 74.8,44.58 66.55,44.58 66.23,44.9 60.2,50.93 35.12,50.93 30.99,55.05 IC1.4
N$25
  Top 0.305: IC1.5 33.53,55.05 36.7,51.88 60.52,51.88 66.55,45.85 66.87,45.53 73.21,45.53 73.53,45.85 JP2.7
N$26
  Top 0.305: JP2.5 71.95,46.8 71.63,46.48 67.18,46.48 66.87,46.8 60.83,52.83 38.29,52.83 36.07,55.05 IC1.6
N$27
  Top 0.305: IC1.7 38.61,55.05 39.88,53.79 61.15,53.79 67.5,47.43 70.04,47.43 JP2.3
N$28
  Top 0.305: JP2.4 71.63,53.47 71.31,53.79 62.42,53.79 61.47,54.74 41.47,54.74 41.15,55.05 IC1.8
N$29
  Top 0.305: JP2.6 74.17,53.47 72.9,54.74 63.37,54.74 62.74,55.37 62.74,59.18 62.1,59.82 44.32,59.82 43.69,59.18 IC1.9
N$30
  Bottom 0.305: JP2.8 75.44,50.29 75.44,47.75 74.8,47.12 68.77,47.12 65.28,50.61 57.66,50.61 53.85,54.42 IC2.2
N$31
  Bottom 0.305: IC2.3 56.39,54.9 58.29,52.99 77.82,52.99 JP2.10
N$32
  Bottom 0.305: JP2.12 79.57,53.79 60.2,53.79 58.93,55.05 IC2.4
N$33
  Bottom 0.305: JP2.14 81.15,54.74 61.79,54.74 61.47,55.05 IC2.5
N$34
  Top 0.305: IC2.6 64.01,58.55 64.33,58.86 85.28,58.86 85.6,58.55 85.6,54.74 86.87,53.47 JP2.16
N$35
  Bottom 0.305: JP2.18 89.41,52.67 87.66,54.42 86.23,54.42 85.6,55.05 85.6,58.55 85.28,58.86 82.1,58.86 81.79,58.55 IC3.2
N$36
  Bottom 0.305: JP2.17 88.14,50.29 88.14,52.51 87.19,53.47 84.96,53.47 84.33,54.1 IC3.3
N$37
  Bottom 0.305: IC3.4 86.87,58.55 87.19,58.86 90.36,58.86 90.68,58.55 90.68,54.42 91.95,53.15 JP2.20
N$38
  Bottom 0.305: IC3.5 89.41,54.1 90.68,52.83 90.68,50.29 JP2.19
N$39
  Bottom 0.305: IC3.6 91.95,55.37 94.49,52.83 JP2.22
N$40
  Bottom 0.305: JP2.21 95.76,50.29 95.76,53.15 94.49,54.42 IC3.7
N$41
  Bottom 0.305: JP2.24 IC3.8
N$42
  Bottom 0.305: JP2.23 98.3,50.29 98.3,53.15 99.57,54.42 IC3.9
N$43
  Bottom 0.61: JP6.PWR 10.92,73.79 D1.A
N$44
  Bottom 0.61: D1.C 3.68,68.39 1.46,66.17 1.46,18.54 2.73,17.27 5.59,17.27 7.18,15.68 7.18,11.88 10.35,8.7 S2.5 S2.2
N$45
  Bottom 0.305: R11.2 R2.2 84.33,24.57 81.79,22.04 R1.1
N$46
  Bottom 0.305: R11.1 84.33,31.88 R12.2 R3.2
N$47
  Bottom 0.305: R53.1 22.1,44.58 20.83,45.85 20.83,51.24 21.14,51.56 21.14,71.25 23.56,73.66 RCA.LS
N$49
  Bottom 0.305: R21.2 11.62,10.6
  Bottom 0.61: S2.1 S2.4 12.89,9.33 11.62,10.6 10.35,11.88 9.4,11.88 8.45,12.83 8.45,16.95 6.86,18.54 6.86,35.37 5.91,36.32 3.37,36.32 2.73,36.96 2.73,57.59 4.32,59.18 IC5.1 9.08,59.18 11.62,56.64 C4.+
N$50
  Bottom 0.305: R12.1 86.87,31.88 R13.2 R4.2
N$51
  Bottom 0.305: R13.1 89.41,31.88 R14.2 R5.2
N$52
  Bottom 0.305: R14.1 91.95,31.88 R15.2 R6.2
N$53
  Bottom 0.305: R15.1 94.49,31.88 R16.2 R7.2
N$54
  Bottom 0.305: R16.1 97.03,31.88 R17.2 R8.2
N$55
  Bottom 0.305: R9.2 R18.2 99.57,31.88 R17.1
N$57
  Bottom 0.305: T2.B 48.77,44.58 50.04,43.31 R19.1 T1.E
N$58
  Bottom 0.305: PWR.A 3.05,9.65 R21.1
N$59
  Bottom 0.305: RESET.1 12.93,15.01 13.21,14.73 R25.2
N$62
  Bottom 0.305: R29.2 R28.2 38.61,16 R34.2
N$63
  Bottom 0.305: R30.2 R34.1 38.61,18.54 R35.2
N$64
  Bottom 0.305: R31.2 R35.1 38.61,21.08 R36.2
N$65
  Bottom 0.305: R32.2 R36.1 38.61,23.62 R37.2
N$67
  Bottom 0.305: T4.B 29.4,45.21 30.67,43.94 R40.1 T3.E
N$68
  Bottom 0.305: RCA.HS 19.62,52.26 18.92,51.56 18.92,34.42 19.56,33.78 22.41,33.78 C8.-
RST
  Bottom 0.305: R25.1 15.75,25.84 17.65,27.75 54.48,27.75 59.88,22.35 65.28,22.35 65.6,22.04 65.6,15.05 65.28,14.73 62.74,14.73 JP5.25
SL
  Bottom 0.305: JP4.5 72.9,4.57 72.9,8.06 71.63,9.33 R26.1 71.63,14.1 70.36,15.37 70.36,26.8 69.72,27.43 58.93,27.43 57.66,28.7 17.34,28.7 15.79,30.25 SELECT.1
ST
  Top 0.305: R27.1 76.71,21.72 73.53,24.89 57.98,24.89 55.44,22.35 21.78,22.35 19.24,19.81 14.48,19.81 11.66,22.63 START.1
  Bottom 0.305: JP4.7 75.44,4.57 75.44,18.22 R27.1
VIDEO
  Top 0.305: IC4.5 30.35,45.85 29.72,46.48 23.37,46.48 R53.2

### Text on the board
Bottom: STELLABLUE REV 0.3
tPlace: StellaBlue | Reinaldo Flamino / Danjovic 2016
tDocu: GND